# EAGLE design AFE_Only_ReplacedDischarge (EAGLE 8.0.2)

## Sheet 1 of 2
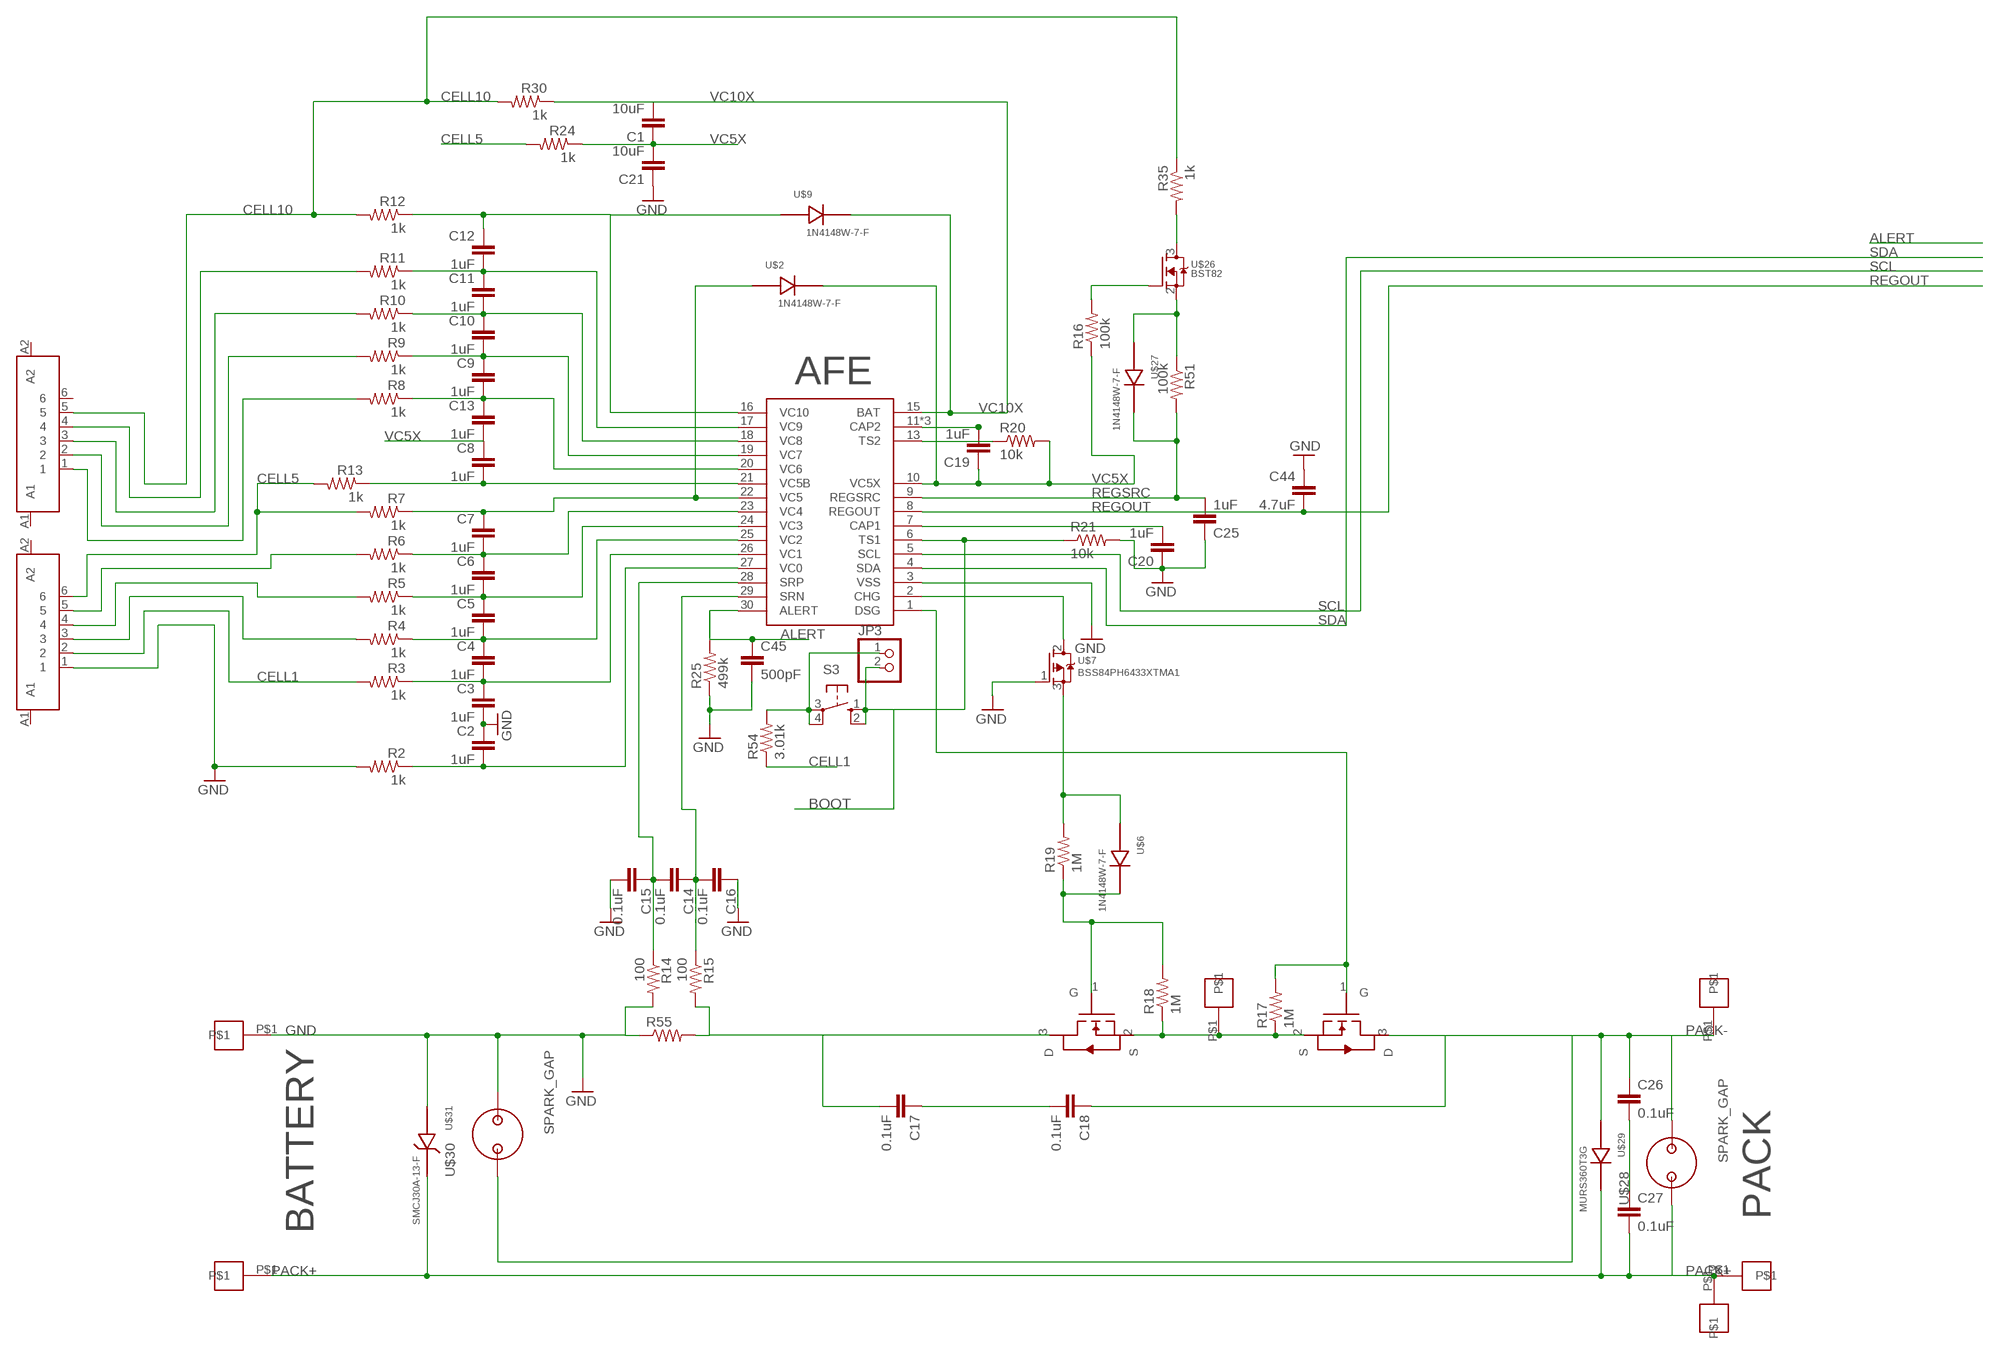
[diagram p0: schematic, sheet 1]

### Parts
C1  10uF  C-EUC1210  [C1210]
C2  1uF  C-EUC0805  [C0805]
C3  1uF  C-EUC0805  [C0805]
C4  1uF  C-EUC0805  [C0805]
C5  1uF  C-EUC0805  [C0805]
C6  1uF  C-EUC0805  [C0805]
C7  1uF  C-EUC0805  [C0805]
C8  1uF  C-EUC0805  [C0805]
C9  1uF  C-EUC0805  [C0805]
C10  1uF  C-EUC0805  [C0805]
C11  1uF  C-EUC0805  [C0805]
C12  1uF  C-EUC0805  [C0805]
C13  1uF  C-EUC0805  [C0805]
C14  0.1uF  C-EUC0805  [C0805]
C15  0.1uF  C-EUC0805  [C0805]
C16  0.1uF  C-EUC0805  [C0805]
C17  0.1uF  C-EUC0805  [C0805]
C18  0.1uF  C-EUC0805  [C0805]
C19  1uF  C-EUC0805  [C0805]
C20  1uF  C-EUC0805  [C0805]
C21  10uF  C-EUC1210  [C1210]
C25  1uF  C-EUC0805  [C0805]
C26  0.1uF  C-EUC0805  [C0805]
C27  0.1uF  C-EUC0805  [C0805]
C44  4.7uF  C-EUC0805  [C0805]
C45  500pF  C-EUC0603  [C0603]
JP3  PINHD-1X2  [1X02]
R2  1k  R-US_R1206  [R1206]
R3  1k  R-US_R1206  [R1206]
R4  1k  R-US_R1206  [R1206]
R5  1k  R-US_R1206  [R1206]
R6  1k  R-US_R1206  [R1206]
R7  1k  R-US_R1206  [R1206]
R8  1k  R-US_R1206  [R1206]
R9  1k  R-US_R1206  [R1206]
R10  1k  R-US_R1206  [R1206]
R11  1k  R-US_R1206  [R1206]
R12  1k  R-US_R1206  [R1206]
R13  1k  R-US_R1206  [R1206]
R14  100  R-US_R0805  [R0805]
R15  100  R-US_R0805  [R0805]
R16  100k  R-US_R0805  [R0805]
R17  1M  R-US_R1206  [R1206]
R18  1M  R-US_R1206  [R1206]
R19  1M  R-US_R1206  [R1206]
R20  10k  R-US_R0805  [R0805]
R21  10k  R-US_R0805  [R0805]
R24  1k  R-US_R1206  [R1206]
R25  499k  R-US_R0603  [R0603]
R30  1k  R-US_R1206  [R1206]
R35  1k  R-US_R1206  [R1206]
R51  100k  R-US_R0805  [R0805]
R54  3.01k  R-US_R1206  [R1206]
R55  R-US_R2512  [R2512]
S3  10-XX  [B3F-10XX]
U$1  BQ76930  [SOIC-30]
U$2  1N4148W-7-F  [SOD-123]
U$3  PAD  [PAD]
U$4  AOB290L  [TO-263]
U$5  AOB290L  [TO-263]
U$6  1N4148W-7-F  [SOD-123]
U$7  BSS84PH6433XTMA1  [SOT23-3]
U$9  1N4148W-7-F  [SOD-123]
U$24  JST_6PIN  [JST_6PIN]
U$26  BST82  [SOT23-3]
U$27  1N4148W-7-F  [SOD-123]
U$28  SPARK_GAP  [SPARK_GAP]
U$29  MURS360T3G  [SMC(DO-214AB)]
U$30  SPARK_GAP  [SPARK_GAP]
U$31  SMCJ30A-13-F  [SMB(DO-214AA)]
U$33  JST_6PIN  [JST_6PIN]
U$35  PAD  [PAD]
U$36  PAD  [PAD]
U$37  PAD  [PAD]
U$38  PAD  [PAD]
U$39  PAD  [PAD]

### Nets
ALERT: C45.1 R25.2 U$1.30(ALERT) ; also sheet 2
BOOT: JP3.2 R21.1 S3.1(S) S3.2(S1) U$1.6(TS1)
CELL1: R3.2 R54.1 U$33.2
CELL5: R7.2 R13.2 R24.2 U$33.6
CELL10: R12.2 R30.2 R35.1 U$24.5
CHARGE-: R17.1 R18.1 U$4.2(S) U$5.2(S) U$37.P$1
GND: C2.1 C3.2 C15.2 C16.1 C20.1 C21.1 C25.1 C44.1 C45.2 R2.2 R14.2 R21.2 R25.1 R55.1 U$1.3(VSS) U$3.P$1 U$7.1(G) U$30.P$2 U$31.P$1 U$33.1 ; also sheet 2
N$1: C3.1 C4.2 R3.1 U$1.26(VC1)
N$2: C4.1 C5.2 R4.1 U$1.25(VC2)
N$3: C5.1 C6.2 R5.1 U$1.24(VC3)
N$4: C6.1 C7.2 R6.1 U$1.23(VC4)
N$5: C7.1 R7.1 U$1.22(VC5) U$2.P$1
N$6: C8.2 R13.1 U$1.21(VC5B)
N$7: C9.1 C10.2 R9.1 U$1.19(VC7)
N$8: C10.1 C11.2 R10.1 U$1.18(VC8)
N$9: C11.1 C12.2 R11.1 U$1.17(VC9)
N$10: C12.1 R12.1 U$1.16(VC10) U$9.P$1
N$11: R5.2 U$33.4
N$12: C2.2 R2.1 U$1.27(VC0)
N$14: C26.2 C27.1
N$15: R4.2 U$33.3
N$16: R6.2 U$33.5
N$18: R8.2 U$24.1
N$19: R9.2 U$24.2
N$20: R10.2 U$24.3
N$21: R11.2 U$24.4
N$23: C9.2 C13.1 R8.1 U$1.20(VC6)
N$24: R16.2 U$26.1(G)
N$25: C20.2 U$1.7(CAP1)
N$26: C14.1 C16.2 R15.1 U$1.29(SRN)
N$27: JP3.1 R54.2 S3.3(P) S3.4(P1)
N$28: C14.2 C15.1 R14.1 U$1.28(SRP)
N$32: R18.2 R19.1 U$5.1(G) U$6.P$2
N$33: R19.2 U$6.P$1 U$7.3(D)
N$34: U$1.2(CHG) U$7.2(S)
N$35: C17.1 C18.2
N$37: C19.2 U$1.11(CAP2) U$1.12(CAP2) U$1.14(CAP2)
N$38: R20.1 U$1.13(TS2)
N$39: C17.2 R15.2 R55.2 U$5.3(D)
N$42: R17.2 U$1.1(DSG) U$4.1(G)
N$70: R51.1 U$26.2(S) U$27.P$1
N$72: R35.2 U$26.3(D)
PACK+: C27.2 U$28.P$1 U$29.2 U$31.P$2 U$35.P$1 U$36.P$1 U$39.P$1
PACK-: C18.1 C26.1 U$4.3(D) U$28.P$2 U$29.1 U$30.P$1 U$38.P$1
REGOUT: C44.2 U$1.8(REGOUT) ; also sheet 2
REGSRC: C25.2 R51.2 U$1.9(REGSRC) U$27.P$2
SCL: U$1.5(SCL) ; also sheet 2
SDA: U$1.4(SDA) ; also sheet 2
VC5X: C1.1 C8.1 C13.2 C19.1 C21.2 R16.1 R20.2 R24.1 U$1.10(VC5X) U$2.P$2
VC10X: C1.2 R30.1 U$1.15(BAT) U$9.P$2
Unconnected: U$24.6 U$24.A1 U$24.A2 U$33.A1 U$33.A2

### Notes on the sheet
- AFE
- PACK
- BATTERY

## Sheet 2 of 2
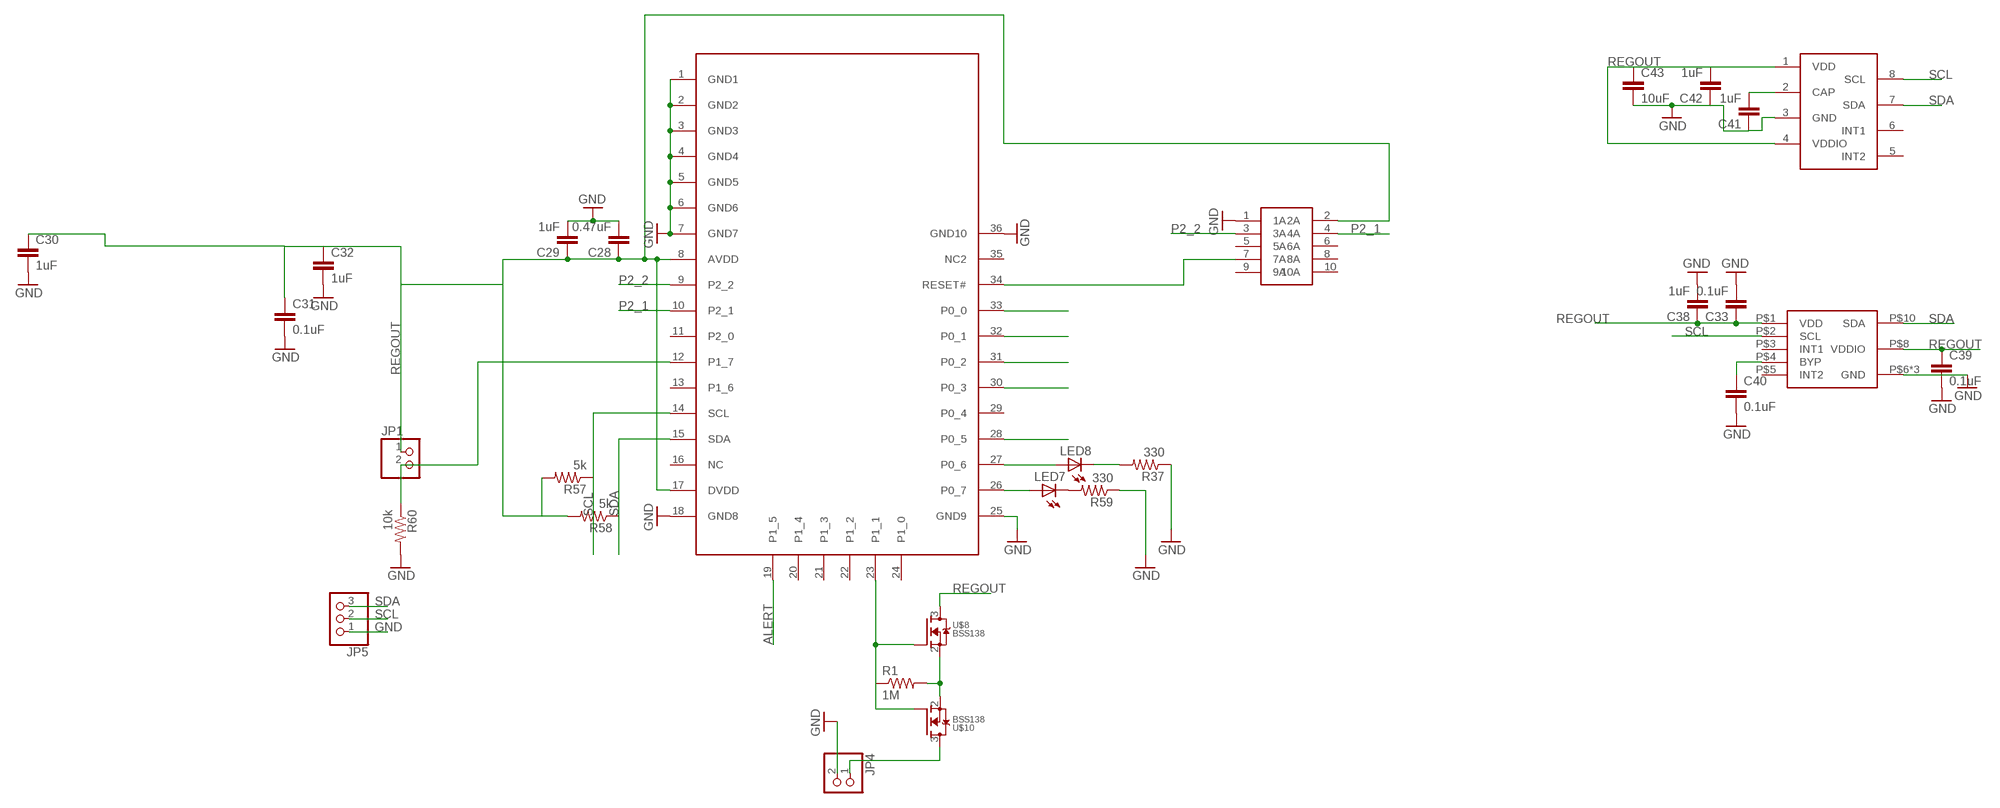
[diagram p1: schematic, sheet 2]

### Parts
C28  0.47uF  C-EUC0402  [C0402]
C29  1uF  C-EUC0402  [C0402]
C30  1uF  C-EUC0402  [C0402]
C31  0.1uF  C-EUC0402  [C0402]
C32  1uF  C-EUC0402  [C0402]
C33  0.1uF  C-EUC0402  [C0402]
C38  1uF  C-EUC0402  [C0402]
C39  0.1uF  C-EUC0402  [C0402]
C40  0.1uF  C-EUC0402  [C0402]
C41  1uF  C-EUC0402  [C0402]
C42  1uF  C-EUC0402  [C0402]
C43  10uF  C-EUC0603  [C0603]
JP1  PINHD-1X2  [1X02]
JP4  PINHD-1X2  [1X02]
JP5  PINHD-1X3  [1X03]
LED7  LEDCHIP-LED0603  [CHIP-LED0603]
LED8  LEDCHIP-LED0603  [CHIP-LED0603]
R1  1M  R-US_R0402  [R0402]
R37  330  R-US_R0402  [R0402]
R57  5k  R-US_R0402  [R0402]
R58  5k  R-US_R0402  [R0402]
R59  330  R-US_R0402  [R0402]
R60  10k  R-US_R0402  [R0402]
U$8  BSS138  [SOT23-3]
U$10  BSS138  [SOT23-3]
U$20  BLE113  [BLUEGIGA]
U$22  RIBBON_10POS_MALE  [RIBBON_10POS_MALE]
U$25  MLP3115A2  [MLP3115A2]
U$32  MMA8653FC  [10-DFN2X2]

### Nets
ALERT: U$20.19(P1_5) ; also sheet 1
CARD2: U$20.32(P0_1)
CD: U$20.33(P0_0)
CLK: U$20.28(P0_5)
GND: C28.2 C29.2 C30.2 C31.2 C32.2 C33.2 C38.2 C39.2 C40.2 C41.1 C42.1 C43.2 JP4.2 JP5.1 R37.1 R59.1 R60.2 U$20.1(GND1) U$20.2(GND2) U$20.3(GND3) U$20.4(GND4) U$20.5(GND5) U$20.6(GND6) U$20.7(GND7) U$20.18(GND8) U$20.25(GND9) U$20.36(GND10) U$22.1(1A) U$25.3(GND) U$32.P$6(GND) U$32.P$7(GND) U$32.P$9(GND) ; also sheet 1
MISO: U$20.31(P0_2)
MOSI: U$20.30(P0_3)
N$13: LED8.A U$20.27(P0_6)
N$17: LED8.C R37.2
N$22: R1.1 U$8.1(G) U$10.1(G) U$20.23(P1_1)
N$29: JP4.1 U$10.3(D)
N$30: R1.2 U$8.2(S) U$10.2(S)
N$36: LED7.A U$20.26(P0_7)
N$71: JP1.2 R60.1 U$20.12(P1_7)
N$76: LED7.C R59.2
N$77: U$20.34(RESET#) U$22.7(7A)
N$81: C41.2 U$25.2(CAP)
N$84: C40.1 U$32.P$4(BYP)
P2_1: U$20.10(P2_1) U$22.4(4A)
P2_2: U$20.9(P2_2) U$22.3(3A)
REGOUT: C28.1 C29.1 C30.1 C31.1 C32.1 C33.1 C38.1 C39.1 C42.2 C43.1 JP1.1 R57.2 R58.2 U$8.3(D) U$20.8(AVDD) U$20.17(DVDD) U$22.2(2A) U$25.1(VDD) U$25.4(VDDIO) U$32.P$1(VDD) U$32.P$8(VDDIO) ; also sheet 1
SCL: JP5.2 R57.1 U$20.14(SCL) U$25.8(SCL) U$32.P$2(SCL) ; also sheet 1
SDA: JP5.3 R58.1 U$20.15(SDA) U$25.7(SDA) U$32.P$10(SDA) ; also sheet 1
Unconnected: U$20.11(P2_0) U$20.13(P1_6) U$20.16(NC) U$20.20(P1_4) U$20.21(P1_3) U$20.22(P1_2) U$20.24(P1_0) U$20.29(P0_4) U$20.35(NC2) U$22.5(5A) U$22.6(6A) U$22.8(8A) U$22.9(9A) U$22.10(10A) U$25.5(INT2) U$25.6(INT1) U$32.P$3(INT1) U$32.P$5(INT2)

## Library data of the parts
C1-C21 C25-C33 C38-C45 = rcl:C-EU: CAPACITOR, European symbol
JP1 JP3 JP4 = pinhead:PINHD-1X2: PIN HEADER
JP5 = pinhead:PINHD-1X3: PIN HEADER
LED7 LED8 = adafruit:LED: LED OSRAM: - CHIPLED LG R971, LG N971, LY N971, LG Q971, LY Q971, LO R971, LY R971 LH N974, LH R974 LS Q976, LO Q976, LY Q976 LO Q996 - Hyper CHIPLED LW Q18S LB Q993, LB Q99A, LB R99A - SideLED LS A670, LO A670, LY A670, LG A670, LP A670 LB A673, LV A673, LT A673, LW A673 LH A674 LY A675 LS A676, LA A676, LO A676, LY A676, LW A676 LS A679, LY A679, LG A679 - Hyper Micro SIDELED® LS Y876, LA Y876, LO Y876, LY Y876 LT Y87S - SmartLED LW L88C, LW L88S LB L89C, LB L89S, LG L890 LS L89K, LO L89K, LY L89K LS L896, LA L896, LO L896, LY L896 - TOPLED LS T670, LO T670, LY T670, LG T670, LP T670 LSG T670, LSP T670, LSY T670, LOP T670, LYG T670 LG T671, LOG T671, LSG T671 LB T673, LV T673, LT T673, LW T673 LH T674 LS T676, LA T676, LO T676, LY T676, LB T676, LH T676, LSB T676, LW T676 LB T67C, LV T67C, LT T67C, LS T67K, LO T67K, LY T67K, LW E67C LS E67B, LA E67B, LO E67B, LY E67B, LB E67C, LV E67C, LT E67C LW T67C LS T679, LY T679, LG T679 LS T770, LO T770, LY T770, LG T770, LP T770 LB T773, LV T773, LT T773, LW T773 LH T774 LS E675, LA E675, LY E675, LS T675 LS T776, LA T776, LO T776, LY T776, LB T776 LHGB T686 LT T68C, LB T68C - Hyper Mini TOPLED® LB M676 - Mini TOPLED Santana® LG M470 LS M47K, LO M47K, LY M47K Source: http://www.osram.convergy.de/
R1-R21 R24 R25 R30 R35 R37 R51 R54 R55 R57-R60 = rcl:R-US_: RESISTOR, American symbol
S3 = switch-omron:10-XX: OMRON SWITCH; MPN: B3F-1000; OC_FARNELL: 176432; OC_NEWARK: 36M3542
U$1 = Charles:BQ76930
U$2 U$6 U$9 U$27 = Charles:1N4148W-7-F: DIODE GENERAL PURPOSE 100V 300MA
U$3 U$35-U$39 = Charles:PAD
U$4 U$5 = Charles:AOB290L
U$7 = Charles:BSS84PH6433XTMA1: MOSFET P-Channel 60V 170MA SOT-23
U$8 U$10 = Charles:BSS138: MOSFET N-CH 50V 220MA
U$20 = James_Updated:BLE113
U$22 = James_Updated:RIBBON_10POS_MALE
U$24 U$33 = James_Updated:JST_6PIN
U$25 = Charles:MLP3115A2: I2C Precision Altimeter
U$26 = Charles:BST82: MOSFET N-CH 50V 220MA
U$28 U$30 = Charles:SPARK_GAP: Spark Gap 0.2mm ~2kV for ESD Protection
U$29 = Charles:MURS360T3G: Ultrafast Power Rectifier, Diode General Purpose 600V 3A
U$31 = Charles:SMCJ30A-13-F: Zener Diode - 600 Watt Transient Voltage Suppressor - 30VWM 48.4VC - Diode Inc.
U$32 = Charles:MMA8653FC: 3-Axis, 10-bit Digital Accelerometer

## Board
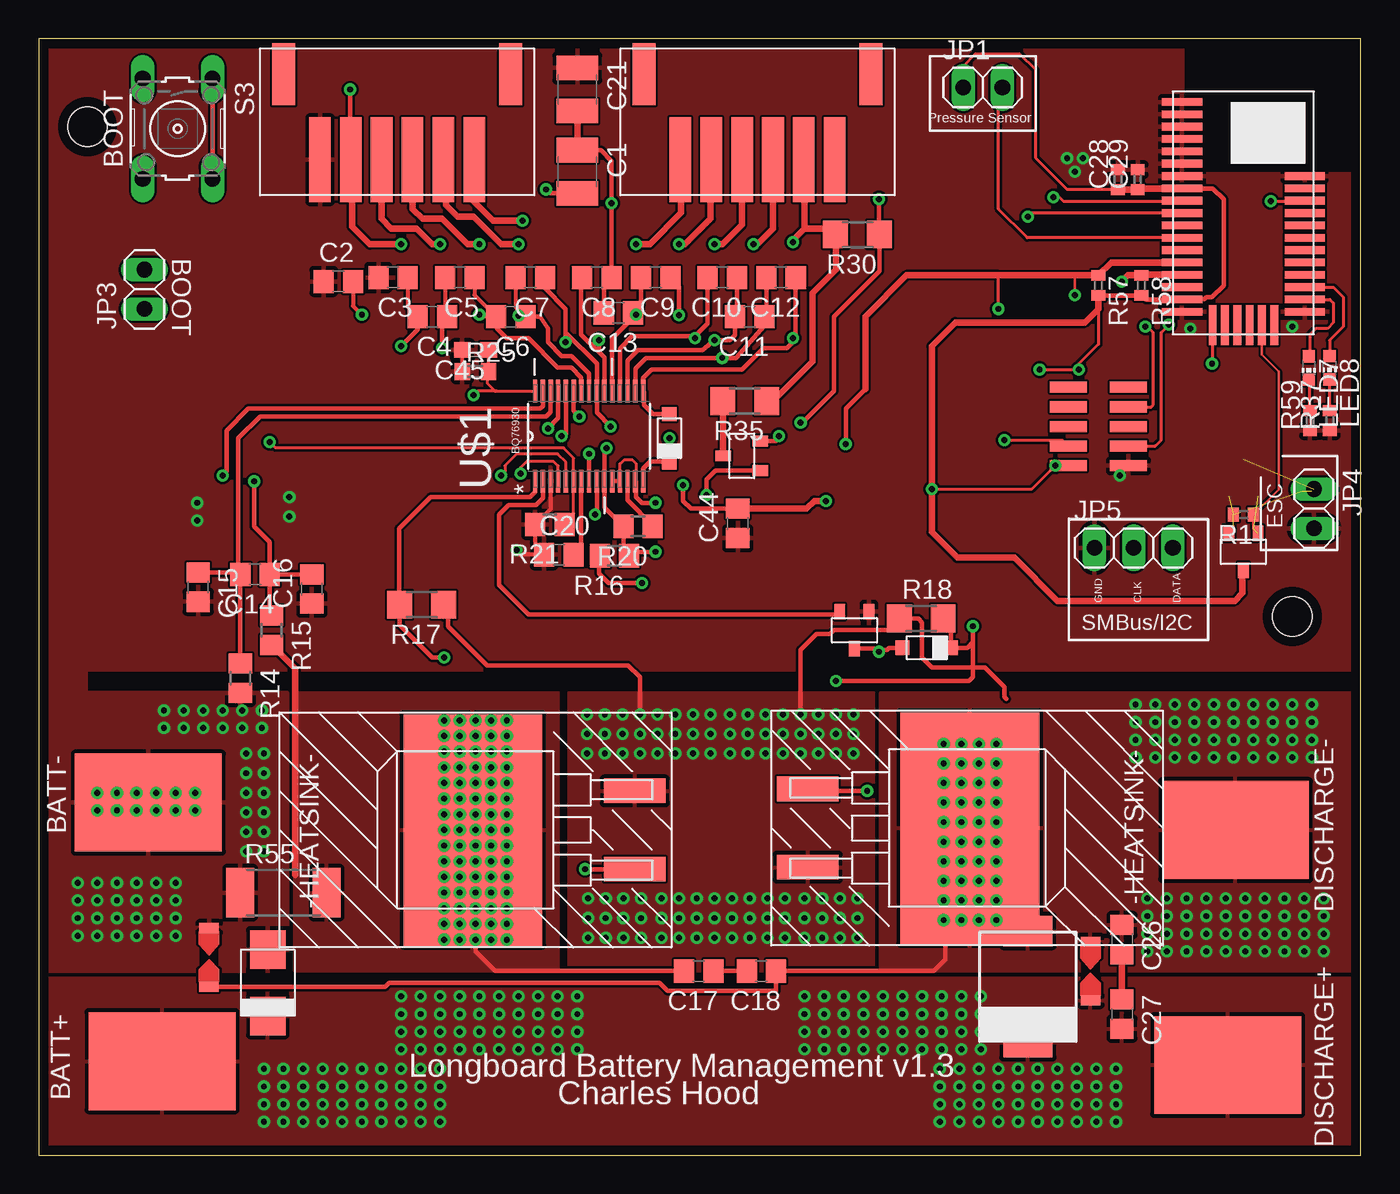
[diagram p2: board, top side]
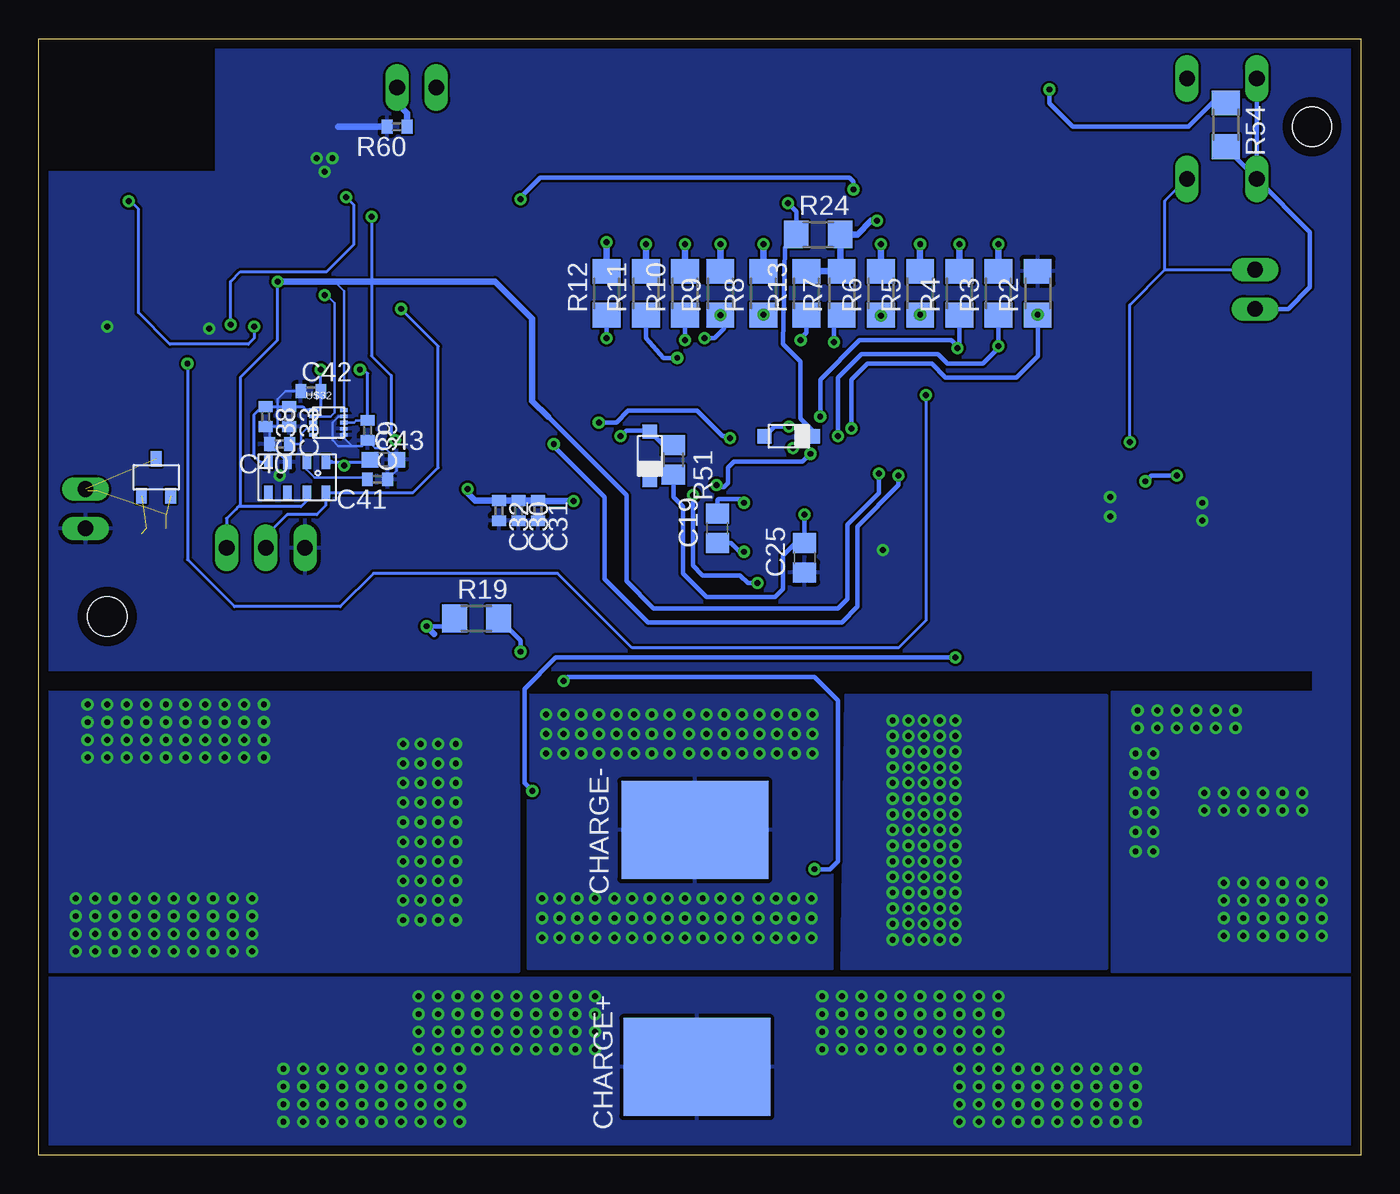
[diagram p3: board, bottom side, seen from below]

Size 85.72 x 72.39 mm. Coordinates in mm from the lower left corner, seen from the top.
Outline: 85.72,0 85.72,72.39 0,72.39 0,0 85.72,0
Copper layers (1*16): Top 0.035mm / dielectric 1.5mm / Bottom 0.035mm
Design rules "DRC_rules": minimum track width 8mil, minimum drill 15mil, track to track 6mil, track to pad 6mil, pad to pad 6mil, via to via 6mil, smd to smd 6mil, copper to edge 25mil, drill to drill 6mil, minimum pad ring 10mil, minimum via ring 8mil, stop-mask expansion 4mil, vias tented up to drill 0mil, thermal gap 10mil
Holes 2.54 mm at 3.17,66.67 81.28,34.92
tRestrict: area 74.3,63.8 to 86.5,72.4
bRestrict: area 74.3,63.8 to 86.5,72.4

### Footprints (pad centres in the part's own frame; a part is rotated, then mirrored left to right if it is on the bottom)
C1210 = smd 1.6 x 2.7: 1 -1.4,0; 2 1.4,0
C0805 = smd 1.3 x 1.5: 1 -0.95,0; 2 0.95,0
C0402 = smd 0.7 x 0.9: 1 -0.65,0; 2 0.65,0
C0603 = smd 1.1 x 1: 1 -0.85,0; 2 0.85,0
1X02 = drill 1.016 long: 1 -1.27,0; 2 1.27,0
1X03 = drill 1.016 long: 1 -2.54,0; 2 0,0; 3 2.54,0
CHIP-LED0603 = smd 0.8 x 0.8: A 0,-0.75; C 0,0.75
R0402 = smd 0.7 x 0.9: 1 -0.65,0; 2 0.65,0
R1206 = smd 1.6 x 1.803: 1 -1.422,0; 2 1.422,0
R0805 = smd 1.3 x 1.5: 1 -0.95,0; 2 0.95,0
R0603 = smd 1 x 1.1: 1 -0.85,0; 2 0.85,0
R2512 = smd 1.8 x 3.2: 1 -2.8,0; 2 2.8,0
B3F-10XX = drill 1.016 long: 1 -3.251,2.261; 2 3.251,2.261; 3 -3.251,-2.261; 4 3.251,-2.261
SOIC-30 = smd 1.473 x 0.279: 1 -2.921,3.505; 2 -2.921,2.997; 3 -2.921,2.489; 4 -2.921,2.007; 5 -2.921,1.499; 6 -2.921,0.991; 7 -2.921,0.508; 8 -2.921,0; 9 -2.921,-0.508; 10 -2.921,-0.991; 11 -2.921,-1.499; 12 -2.921,-2.007; 13 -2.921,-2.489; 14 -2.921,-2.997; 15 -2.921,-3.505; 16 2.921,-3.505; 17 2.921,-2.997; 18 2.921,-2.489; 19 2.921,-2.007; 20 2.921,-1.499; 21 2.921,-0.991; 22 2.921,-0.508; 23 2.921,0; 24 2.921,0.508; 25 2.921,0.991; 26 2.921,1.499; 27 2.921,2.007; 28 2.921,2.489; 29 2.921,2.997; 30 2.921,3.505
SOD-123 = smd 0.9 x 0.95: P$1 -1.575,0; P$2 1.575,0
PAD = smd 9.525 x 6.35: P$1 0,0
TO-263 = smd 1.6 x 4: 1 -2.54,-5.25; 2 2.54,-5.25 | smd 15 x 9: 3 0,5.25
SOT23-3 = smd 0.7 x 1: 1 -0.95,-1.2; 2 0.95,-1.2; 3 0,1.2
BLUEGIGA = smd 2.6 x 0.5: 1 -3.975,9.6; 2 -3.975,8.8; 3 -3.975,8; 4 -3.975,7.2; 5 -3.975,6.4; 6 -3.975,5.6; 7 -3.975,4.8; 8 -3.975,4; 9 -3.975,3.2; 10 -3.975,2.4; 11 -3.975,1.6; 12 -3.975,0.8; 13 -3.975,0; 14 -3.975,-0.8; 15 -3.975,-1.6; 16 -3.975,-2.4; 17 -3.975,-3.2; 18 -3.975,-4; 25 3.975,-4; 26 3.975,-3.2; 27 3.975,-2.4; 28 3.975,-1.6; 29 3.975,-0.8; 30 3.975,0; 31 3.975,0.8; 32 3.975,1.6; 33 3.975,2.4; 34 3.975,3.2; 35 3.975,4; 36 3.975,4.8 | smd 0.5 x 2.6: 19 -2,-4.85; 20 -1.2,-4.85; 21 -0.4,-4.85; 22 0.4,-4.85; 23 1.2,-4.85; 24 2,-4.85
RIBBON_10POS_MALE = smd 0.72 x 2.4: 1 -5.08,-1.95; 2 -5.08,1.95; 3 -3.81,-1.95; 4 -3.81,1.95; 5 -2.54,-1.95; 6 -2.54,1.95; 7 -1.27,-1.95; 8 -1.27,1.95; 9 0,-1.95; 10 0,1.95
JST_6PIN = smd 1.4 x 5.5: 1 -5,-2.775; 2 -3,-2.775; 3 -1,-2.775; 4 1,-2.775; 5 3,-2.775; 6 5,-2.775 | smd 1.5 x 4: A1 -7.35,2.775; A2 7.35,2.775
MLP3115A2 = smd 0.95 x 0.55: 1 -1,1.875; 2 -1,0.625; 3 -1,-0.625; 4 -1,-1.875; 5 1,-1.875; 6 1,-0.625; 7 1,0.625; 8 1,1.875
SPARK_GAP = smd 1.27 x 0.635: P$1 0,1.905; P$2 0,-1.905
SMC(DO-214AB) = smd 1.96 x 3.2: 1 -3.6,0; 2 3.6,0
SMB(DO-214AA) = smd 2.5 x 2.3: P$1 -2.15,0; P$2 2.15,0
10-DFN2X2 = smd 0.5 x 0.24: P$1 -1,0.8; P$2 -1,0.4; P$3 -1,0; P$4 -1,-0.4; P$5 -1,-0.8; P$6 1,-0.8; P$7 1,-0.4; P$8 1,0; P$9 1,0.4; P$10 1,0.8

### Placement (x,y rotation side)
C1  34.92,63.75 270 top
C2  19.43,56.64 0 top
C3  22.99,56.9 180 top
C4  25.53,54.36 180 top
C5  27.3,56.9 180 top
C6  30.61,54.36 180 top
C7  31.88,56.9 180 top
C8  36.2,56.9 180 top
C9  40.01,56.9 180 top
C10  44.32,56.9 180 top
C11  46.1,54.36 180 top
C12  48.13,56.9 180 top
C13  37.59,54.61 180 top
C14  14.03,37.66 180 top
C15  10.35,36.83 270 top
C16  17.72,36.7 90 top
C17  42.8,11.94 180 top
C18  46.86,11.94 180 top
C19  41.72,40.64 90 bottom
C20  33.72,38.93 0 top
C21  34.92,69.09 270 top
C25  36.07,38.73 90 bottom
C26  70.23,13.97 270 top
C27  70.23,9.14 270 top
C28  69.98,63.25 90 top
C29  71.25,63.25 90 top
C30  54.61,41.78 270 bottom
C31  53.34,41.78 270 bottom
C32  55.88,41.78 270 bottom
C33  69.47,47.88 270 bottom
C38  70.99,47.88 270 bottom
C39  64.39,46.99 270 bottom
C40  70.1,46.1 180 bottom
C41  63.75,43.81 180 bottom
C42  68.07,49.53 0 bottom
C43  63.37,45.09 0 bottom
C44  45.33,40.96 90 top
C45  28.32,52.2 180 top
JP1  61.21,69.22 0 top
JP3  6.86,56.13 90 top
JP4  82.68,41.91 270 top
JP5  70.99,39.37 0 top
LED7  82.35,51.03 180 top
LED8  83.69,51.05 180 top
R1  78.1,41.53 180 top
R2  20.95,55.88 90 bottom
R3  23.5,55.88 90 bottom
R4  26.04,55.88 90 bottom
R5  28.58,55.88 90 bottom
R6  31.12,55.88 90 bottom
R7  33.66,55.88 90 bottom
R8  38.73,55.88 90 bottom
R9  41.53,55.88 90 bottom
R10  43.81,55.88 90 bottom
R11  46.35,55.88 90 bottom
R12  48.9,55.88 90 bottom
R13  35.94,55.88 90 bottom
R14  13.08,30.92 270 top
R15  15.11,34.04 270 top
R16  37.34,38.86 180 top
R17  24.83,35.69 180 top
R18  57.23,34.8 0 top
R19  57.33,34.8 0 bottom
R20  38.86,40.77 180 top
R21  33.15,40.89 180 top
R24  35.18,59.69 0 bottom
R25  28.32,50.8 0 top
R30  53.09,59.69 180 top
R35  45.78,48.9 180 top
R37  83.69,47.62 90 top
R51  44.58,45.09 270 bottom
R54  8.76,66.8 270 bottom
R55  15.88,17.02 0 top
R57  68.71,56.39 270 top
R58  71.5,56.39 270 top
R59  82.42,47.62 90 top
R60  62.48,66.67 180 bottom
S3  9.02,66.55 270 top
U$1  35.69,46.61 90 top
U$2  37.08,46.61 0 bottom
U$3  7.11,22.86 0 top
U$4  55.12,21.21 270 top
U$5  33.4,21.08 90 top
U$6  57.58,32.89 0 top
U$7  52.88,34.04 180 top
U$8  78.1,39.12 180 top
U$9  40.89,46.48 270 top
U$10  78.1,43.94 0 bottom
U$20  78.1,58.67 0 top
U$22  68.71,49.78 90 top
U$24  46.61,67.31 0 top
U$25  68.96,43.94 270 bottom
U$26  45.59,45.34 90 top
U$27  46.1,45.34 270 bottom
U$28  68.2,11.94 180 top
U$29  64.13,10.92 270 top
U$30  11.05,12.83 180 top
U$31  14.86,11.18 270 top
U$32  66.93,47.5 0 bottom
U$33  23.24,67.31 0 top
U$35  8,6.1 0 top
U$36  77.09,5.84 180 top
U$37  43.18,21.08 180 bottom
U$38  77.6,21.08 0 top
U$39  43.05,5.71 180 bottom

### Tracks (layer width: path | path; a pad name or v marks a point on that pad's centre or on a via)
ALERT  (via drill 0.38)
  Top 0.203: 29.72,49.53 U$1.30 | 29.72,49.53 29.59,49.53 | 29.59,49.53 29.08,50.04 29.08,50.42 29.08,50.71 R25.2 C45.1 | 29.72,49.53 28.45,49.53 v28.19,49.28 | U$20.19 76.1,51.34 v76.07,51.31 | 29.59,49.53 29.72,49.53
  Top 0.254: R25.2 29.17,50.51 29.08,50.42
  Bottom 0.203: v28.19,49.28 28.19,34.67 29.97,32.89 47.24,32.89 52.07,37.72 64.01,37.72 66.17,35.56 73.03,35.56 76.07,38.61 v76.07,51.31
BOOT  (via drill 0.38)
  Top 0.203: R21.1 34.7,41.62 U$1.6 34.7,45.19 34.04,45.85 15.37,45.85 v14.99,46.23
  Top 0.305: S3.2 S3.1
  Bottom 0.203: v14.99,46.23 14.99,55.12 12.7,57.4 | 12.7,57.4 JP3.2 | 12.7,57.4 12.7,61.87 S3.2
CELL1  (via drill 0.38)
  Top 0.305: v20.19,69.09 20.19,64.58 U$33.2
  Top 0.406: v23.5,59.05 21.46,59.05 20.32,60.2 20.32,64.46 U$33.2
  Bottom 0.305: R54.1 9.63,68.22 11.18,66.67 18.67,66.67 20.19,68.2 v20.19,69.09
  Bottom 0.406: R3.2 v23.5,59.05
CELL5  (via drill 0.38)
  Top 0.406: v31.37,60.58 29.46,60.58 28.19,61.85 28.19,64.49 U$33.6
  Bottom 0.406: v31.37,60.58 31.75,60.58 32.64,59.69 R24.2 33.76,57.4 R7.2 R13.2
CELL10  (via drill 0.38)
  Top 0.406: v48.9,59.18 48.9,59.31 49.66,60.07 | 49.66,60.07 49.66,64.49 U$24.5 | 49.66,60.07 51.28,60.07 R30.2 51.69,59.66 51.69,57.4 50.16,55.88 50.16,51.44 47.62,48.9 R35.1
  Bottom 0.406: v48.9,59.18 R12.2
CHARGE-  (via drill 0.38)
  Top 0.203: R17.1 26.25,34.84
  Top 0.305: 62.74,29.59 62.61,29.72 62.61,30.35 61.34,31.62 57.91,31.62 57.28,32.26 57.28,34.54 57.02,34.8 R18.1 55.04,34.04 51.56,34.04 51.31,33.78 50.42,33.78 49.4,32.77 v49.4,28.57 | v38.99,28.57 38.99,30.99 38.23,31.75 29.08,31.75 26.54,34.29 26.54,35.4 R17.1
  other vias: 44.83,26.04 44.83,27.3 44.83,28.57 45.97,26.04 45.97,27.3 45.97,28.57 47.12,26.04 47.12,27.3 47.12,28.57 48.26,26.04 48.26,27.3 48.26,28.57 50.8,14.1 50.8,15.37 50.8,16.64 49.66,14.1 49.66,15.37 49.66,16.64 51.94,14.1 51.94,15.37 51.94,16.64 53.09,14.1 53.09,15.37 53.09,16.64 36.7,26.04 36.7,27.3 36.7,28.57 35.56,26.04 35.56,27.3 35.56,28.57 37.85,26.04 37.85,27.3 37.85,28.57 38.99,26.04 38.99,27.3 36.77,14.1 36.77,15.37 36.77,16.64 35.62,14.1 35.62,15.37 35.62,16.64 37.91,14.1 37.91,15.37 37.91,16.64 39.05,14.1 39.05,15.37 39.05,16.64 49.4,26.04 49.4,27.3 50.55,26.04 50.55,27.3 50.55,28.57 51.69,26.04 51.69,27.3 51.69,28.57 52.83,26.04 52.83,27.3 52.83,28.57 41.27,26.04 41.27,27.3 41.27,28.57 40.13,26.04 40.13,27.3 40.13,28.57 42.42,26.04 42.42,27.3 42.42,28.57 43.56,26.04 43.56,27.3 43.56,28.57 41.53,14.1 41.53,15.37 41.53,16.64 40.39,14.1 40.39,15.37 40.39,16.64 42.67,14.1 42.67,15.37 42.67,16.64 43.81,14.1 43.81,15.37 43.81,16.64 46.1,14.1 46.1,15.37 46.1,16.64 44.96,14.1 44.96,15.37 44.96,16.64 47.24,14.1 47.24,15.37 47.24,16.64 48.39,14.1 48.39,15.37 48.39,16.64
  pour Bottom: 34.29,12.06 53.98,12.06 53.98,29.84 34.29,29.84
  pour Top: 34.42,11.94 34.42,29.97 54.1,29.97 54.1,11.94
GND  (via drill 0.38)
  Top 0.203: U$22.1 70.66,44.62 v70.1,44.07 | C45.2 R25.1
  Top 0.254: U$1.3 33.2,41.9 R21.2 32.2,39.5 C20.1 31.18,38.92 30.99,39.12 v30.99,39.24
  Bottom 0.152: U$25.3 C40.2 70.75,46.99 C38.2 70.23,47.23 | C33.2 70.23,47.23 | C42.1 69.72,49.53 70.23,49.02 70.23,47.23 | U$32.P$9 66.28,47.9 66.68,47.5 66.68,46.35 66.29,45.97 65.41,45.97 | 65.41,45.97 64.75,45.97 C39.2 63.9,45.85 63.25,45.85 62.52,45.12 C43.2 62.52,44.4 C41.1 | U$32.P$6 65.93,46.5 65.41,45.97
  Bottom 0.203: U$32.P$7 U$32.P$6 | U$25.3 69.59,44.59 v70.1,44.07 70.23,43.94
  Bottom 0.406: R60.2 66.31,66.67
  other vias: 81.28,53.72 74.68,53.59 10.29,42.29 10.29,41.15 16.26,42.67 16.26,41.4 66.68,64.64 67.69,64.64 67.18,63.75 2.54,17.65 3.81,17.65 5.08,17.65 6.35,17.65 7.62,17.65 8.89,16.51 8.89,17.65 8.89,15.37 2.54,16.51 3.81,16.51 5.08,16.51 6.35,16.51 7.62,16.51 2.54,15.37 3.81,15.37 5.08,15.37 6.35,15.37 7.62,15.37 2.54,14.22 3.81,14.22 5.08,14.22 6.35,14.22 7.62,14.22 8.89,14.22 3.81,23.5 5.08,23.5 6.35,23.5 7.62,23.5 8.89,23.5 10.16,22.35 10.16,23.5 3.81,22.35 5.08,22.35 6.35,22.35 7.62,22.35 8.89,22.35 8.13,28.83 9.4,28.83 10.67,28.83 11.94,28.83 13.21,28.83 14.48,27.69 14.48,28.83 8.13,27.69 9.4,27.69 10.67,27.69 11.94,27.69 13.21,27.69 13.46,19.68 13.46,20.95 13.46,22.23 13.46,23.5 13.46,24.77 14.61,26.04 13.46,26.04 14.61,19.68 14.61,20.95 14.61,22.23 14.61,23.5 14.61,24.77
  pour Top: 0,72.39 85.72,72.39 85.72,31.5 3.05,31.5 3.05,29.97 16.13,29.97 16.13,11.94 0,11.94
  pour Bottom: 0,31.5 85.72,31.5 85.72,72.14 0,72.14
  pour Bottom: 0,31.5 3.05,31.5 3.05,29.97 16.13,29.97 16.13,11.94 0,11.94
N$1  (via drill 0.38)
  Top 0.254: C3.1 23.94,55 C4.2
  Top 0.305: U$1.26 34.19,46.76 34.04,46.61 v33.91,46.61 | C4.2 24.58,53.53 v23.5,52.45
  Bottom 0.305: v33.91,46.61 33.91,50.42 32.38,51.94 27.43,51.94 26.8,51.31 24.51,51.31 23.5,52.32 v23.5,52.45 R3.1
N$2  (via drill 0.38)
  Top 0.254: C5.2 26.36,54.48 C4.1
  Top 0.305: U$1.25 34.7,48.28 34.67,48.26 v35.05,47.88 | v26.16,52.32 26.16,54.04 C4.1
  Bottom 0.305: v35.05,47.88 35.05,50.29 32.51,52.83 26.54,52.83 26.16,52.45 | 26.16,52.45 v26.16,52.32 | R4.1 26.04,52.58 26.16,52.45
N$3  (via drill 0.38)
  Top 0.254: C5.1 28.26,55.76 C6.2 28.7,54.36 v28.58,54.48
  Top 0.305: U$1.24 35.18,50.42 34.54,51.05 33.66,51.05 31.75,52.96 30.35,52.96 29.72,53.59 29.72,54.3 C6.2
  Bottom 0.203: R5.1 v28.58,54.48
N$4  (via drill 0.38)
  Top 0.254: C7.2 30.93,54.99 C6.1 31.18,54.36 v31.12,54.42
  Top 0.305: U$1.23 35.69,50.67 34.54,51.82 33.91,51.82 33.02,52.7 33.02,53.59 32.51,54.36 C6.1
  Bottom 0.254: v31.12,54.42 R6.1 v31.12,54.42
N$5  (via drill 0.38)
  Top 0.305: 34.16,53.34 36.2,51.31 U$1.22 36.2,48.13 v37.08,47.24 | 34.16,53.34 v34.16,52.7 | C7.1 32.83,56.2 34.16,54.86 34.16,53.34
  Bottom 0.305: v34.16,52.7 34.16,53.95 R7.1 | v37.08,47.24 38.02,47.24 U$2.P$1
N$6  (via drill 0.38)
  Top 0.305: U$1.21 36.68,51.71 36.32,52.07 | 36.32,52.07 35.18,53.21 35.18,56.83 C8.2 | v36.32,52.83 36.32,52.07
  Bottom 0.305: R13.1 35.94,53.34 36.32,52.96 v36.32,52.83
N$7  (via drill 0.38)
  Top 0.305: U$1.19 37.69,52.3 38.48,53.09 42.55,53.09 | 42.55,53.09 v42.55,52.96 | C10.2 43.37,53.91 42.55,53.09 | R9.1 41.53,56.32 C9.1
  Bottom 0.305: v42.55,52.96 41.91,52.96 41.27,53.59 R9.1
  other vias: 41.53,54.46
N$8  (via drill 0.38)
  Top 0.305: U$1.18 38.18,51.51 38.86,52.2 43.05,52.2 v43.81,52.83 44.83,52.83 45.15,53.15 C11.2 45.27,54.48 C10.1
  Bottom 0.305: v43.81,52.83 R10.1
N$9  (via drill 0.38)
  Top 0.305: U$1.17 38.68,51 39.37,51.69 v44.32,51.69 45.21,51.69 47.05,53.78 C11.1 47.18,54.49 C12.2
  Bottom 0.305: v44.32,51.69 45.21,51.69 46.35,52.96 R11.1
N$10  (via drill 0.38)
  Top 0.305: C12.1 49.08,53.15 v48.9,52.96 48.9,52.7 48.51,52.32 46.99,52.32 45.59,50.93 39.75,50.93 39.19,50.37 U$1.16 39.24,49.48 39.24,48.64 39.83,48.06 U$9.P$1
  Bottom 0.305: R12.1 v48.9,52.96
N$11  (via drill 0.38)
  Top 0.406: v28.58,59.05 27.81,59.05 26.16,60.71 24.89,60.71 24.26,61.34 24.26,64.52 U$33.4
  Bottom 0.406: R5.2 v28.58,59.05
N$12  (via drill 0.38)
  Top 0.254: C2.2 20.38,55.06 v20.95,54.48
  Top 0.305: U$1.27 33.68,47.78 v33.02,47.12
  Bottom 0.203: R2.1 v20.95,54.48
  Bottom 0.305: v33.02,47.12 33.02,50.29 32,51.31 27.81,51.31 26.92,50.42 22.35,50.42 20.95,51.82 R2.1
N$13
  Top 0.203: U$20.27 83.93,56.27 84.58,55.63 84.58,53.72 83.69,52.83 LED8.A
N$14
  Top 0.406: C26.2 C27.1
N$15  (via drill 0.38)
  Top 0.406: v26.04,59.05 25.53,59.05 24.51,60.07 22.86,60.07 22.23,60.71 22.23,64.52 U$33.3
  Bottom 0.406: R4.2 v26.04,59.05
N$16  (via drill 0.38)
  Top 0.406: v31.12,59.05 29.97,59.05 28.19,60.83 27.18,60.83 26.42,61.59 26.42,64.36 U$33.5
  Bottom 0.406: v31.12,59.05 R6.2
N$17
  Top 0.203: R37.2 LED8.C
N$18  (via drill 0.38)
  Top 0.406: v38.73,59.05 39.62,59.05 41.66,61.09 41.66,64.49 U$24.1
  Bottom 0.406: R8.2 v38.73,59.05
N$19  (via drill 0.38)
  Top 0.406: v41.53,59.05 41.91,59.05 43.56,60.71 43.56,64.49 U$24.2
  Bottom 0.406: v41.53,59.05 R9.2
N$20  (via drill 0.38)
  Top 0.406: v43.81,59.05 44.32,59.05 45.59,60.33 45.59,64.52 U$24.3
  Bottom 0.406: v43.81,59.05 R10.2
N$21  (via drill 0.38)
  Top 0.406: v46.35,59.05 46.61,59.05 47.62,60.07 47.62,64.52 U$24.4
  Bottom 0.406: R11.2 v46.35,59.05
N$22  (2 unrouted)
  Top 0.152: U$20.23 79.31,51.89 80.39,50.8 80.39,43.16 R1.1 78.75,40.62
N$23  (via drill 0.38)
  Top 0.203: C13.1 38.61,54.61 v38.73,54.48
  Top 0.305: U$1.20 37.19,52.93 38.54,54.29 C13.1 39.05,55.12 C9.2
  Bottom 0.203: v38.73,54.48 R8.1
N$24  (via drill 0.38)
  Top 0.305: U$26.1 43.88,44.39 43.31,43.81 v43.31,42.8 | v39.12,37.08 36.96,37.08 36.32,37.72 36.32,38.8 R16.2
  Bottom 0.305: v43.31,42.8 43.31,38.23 42.67,37.59 40.26,37.59 39.75,37.08 v39.12,37.08
N$25
  Top 0.305: U$1.7 35.18,39.44 C20.2
N$26  (via drill 0.38)
  Top 0.305: U$1.29 32.69,48.56 32.51,48.39 13.59,48.39 12.19,46.99 12.19,44.32 v11.94,44.07 | v13.97,43.69 13.97,40.77 14.99,39.75 C14.1 | C14.1 C16.2 | C14.1 14.98,35.12 R15.1
  Bottom 0.305: v11.94,44.07 13.59,44.07 v13.97,43.69
N$27
  Bottom 0.305: S3.4 S3.3 | R54.2 8.76,65.3 S3.4 | JP3.1 4.7,54.86 3.3,56.26 3.3,59.84 S3.4
N$28
  Top 0.305: U$1.28 33.2,48.18 32.89,47.88 14.35,47.88 12.95,46.48 12.95,37.78 C14.2 | C15.1 12.96,37.78 C14.2 | C14.2 13.08,35.12 R14.1
N$29  (1 unrouted)
N$30  (4 unrouted)
  Top 0.152: 77.46,40.62 U$8.2
N$32  (via drill 0.38)
  Top 0.305: R18.2 59.16,34.29 U$6.P$2 60.2,32.89 60.58,33.27 | 60.58,33.27 v60.58,34.29 | U$5.1 v35.43,18.54 | v51.69,30.73 60.32,30.73 60.58,30.99 60.58,33.27
  Bottom 0.305: v60.58,34.29 59.26,34.29 R19.1 | v35.43,18.54 34.42,18.54 33.91,19.05 33.91,29.46 35.43,30.99 51.44,30.99 v51.69,30.73
  Bottom 0.406: 60.07,33.78 v60.58,34.29
N$33  (via drill 0.38)
  Top 0.305: U$6.P$1 55.12,32.89 54.99,32.77 54.61,32.77 v54.48,32.64 54.29,32.84 U$7.3
  Bottom 0.305: v54.48,32.64 54.48,33.38 R19.2
N$34
  Top 0.305: U$1.2 32.69,42.6 32.26,42.16 30.48,42.16 29.84,41.53 29.84,36.96 31.75,35.05 51.75,35.05 U$7.2
N$35
  Top 0.305: C17.1 C18.2
N$36
  Top 0.203: U$20.26 83.72,55.47 83.95,55.24 83.95,53.98 83.57,53.59 82.8,53.59 82.42,53.21 82.42,51.85 LED7.A
N$37  (via drill 0.38)
  Top 0.203: U$1.12 37.69,44.81 37.97,45.09 38.48,45.09 38.73,44.83 38.73,43.74 U$1.14
  Top 0.305: U$1.11 U$1.12 | v40.01,42.29 39.12,42.29 38.73,42.67 38.73,43.64 U$1.14
  Bottom 0.305: C19.2 41.72,42.48 41.66,42.55 40.26,42.55 v40.01,42.29
N$38
  Top 0.305: U$1.13 38.18,42.47 39.81,40.83 R20.1
N$39  (via drill 0.38)
  Top 0.305: C17.2 29.59,11.94 28.32,13.21 v28.32,13.97
  Top 0.406: 16.64,18.16 16.64,31.56 R15.2
  other vias: 26.29,28.19 27.3,28.19 28.32,28.19 29.34,28.19 30.35,28.19 26.29,27.18 27.3,27.18 28.32,27.18 29.34,27.18 30.35,27.18 26.29,24.13 27.3,24.13 28.32,24.13 29.34,24.13 30.35,24.13 26.29,23.11 27.3,23.11 28.32,23.11 29.34,23.11 30.35,23.11 26.29,26.16 27.3,26.16 28.32,26.16 29.34,26.16 30.35,26.16 26.29,25.15 27.3,25.15 28.32,25.15 29.34,25.15 30.35,25.15 26.29,22.1 27.3,22.1 28.32,22.1 29.34,22.1 30.35,22.1 26.29,21.08 27.3,21.08 28.32,21.08 29.34,21.08 30.35,21.08 26.29,13.97 27.3,13.97 29.34,13.97 30.35,13.97 26.29,16 27.3,16 28.32,16 29.34,16 30.35,16 26.29,14.99 27.3,14.99 28.32,14.99 29.34,14.99 30.35,14.99 26.29,18.03 27.3,18.03 28.32,18.03 29.34,18.03 30.35,18.03 26.29,17.02 27.3,17.02 28.32,17.02 29.34,17.02 30.35,17.02 26.29,20.07 27.3,20.07 28.32,20.07 29.34,20.07 30.35,20.07 26.29,19.05 27.3,19.05 28.32,19.05 29.34,19.05 30.35,19.05
  pour Bottom: 33.66,12.06 33.4,29.84 16.51,29.84 16.51,12.06
  pour Top: 16.64,11.94 16.64,29.97 33.66,29.97 33.66,11.94
N$42  (via drill 0.38)
  Top 0.203: 49.99,23.62 U$4.1
  Top 0.305: U$1.1 32.18,42.98 31.88,42.67 25.4,42.67 23.37,40.64 23.37,35.73 R17.2 23.41,34.38 25.53,32.26 v26.29,32.26 | v53.72,23.62 49.99,23.62
  Bottom 0.305: v26.29,32.26 52.2,32.26 54.23,30.23 54.23,24.13 v53.72,23.62
N$70  (via drill 0.38)
  Top 0.305: U$26.2 47.81,46.29 48.01,46.48 v48.01,46.61
  Bottom 0.305: R51.1 45.22,46.03 U$27.P$1 46.18,46.99 47.62,46.99 v48.01,46.61
N$71
  Top 0.203: U$20.12 64.1,59.47 62.23,61.34 62.23,68.96 JP1.2
  Bottom 0.406: JP1.2 62.48,68.2 61.85,67.56 61.85,66.69 R60.1
N$72
  Top 0.406: R35.2 44.36,45.37 U$26.3
N$76
  Top 0.203: R59.2 82.42,50.2 LED7.C
N$77  (via drill 0.38)
  Top 0.203: U$22.7 72.14,48.51 72.26,48.64 72.26,53.34 71.88,53.72 v71.75,53.72 | v79.88,61.85 82.06,61.85 U$20.34
  Bottom 0.203: v71.75,53.72 71.75,52.96 72.14,52.58 77.22,52.58 79.25,54.61 79.25,61.34 79.76,61.85 v79.88,61.85
N$81
  Bottom 0.152: U$25.2 68.34,44.46 67.82,43.94 64.53,43.94 C41.2
N$84
  Bottom 0.152: U$32.P$4 68.34,47.1 68.71,46.74 68.71,46.23 68.83,46.1 C40.1
P2_1  (via drill 0.38)
  Top 0.203: U$20.10 64.38,61.07 v64.13,60.83 | v62.61,46.35 66.38,46.35 U$22.4
  Bottom 0.203: v64.13,60.83 64.13,51.82 62.87,50.55 62.87,46.61 v62.61,46.35
P2_2  (via drill 0.38)
  Top 0.203: U$22.3 72.39,45.97 72.77,46.35 72.77,53.34 v73.28,53.85 | v65.79,62.1 66.17,62.1 66.42,61.85 74.1,61.85 U$20.9
  Bottom 0.203: v73.28,53.85 73.28,56.64 72.64,57.28 67.06,57.28 65.28,59.05 65.28,61.59 v65.79,62.1
PACK+  (via drill 0.38)
  other vias: 69.85,5.59 68.58,5.59 67.31,5.59 66.04,5.59 64.77,5.59 69.85,4.45 68.58,4.45 67.31,4.45 66.04,4.45 64.77,4.45 69.85,3.3 68.58,3.3 67.31,3.3 66.04,3.3 64.77,3.3 69.85,2.16 68.58,2.16 67.31,2.16 66.04,2.16 64.77,2.16 63.5,2.16 62.23,2.16 60.96,2.16 59.69,2.16 58.42,2.16 63.5,3.3 62.23,3.3 60.96,3.3 59.69,3.3 58.42,3.3 63.5,4.45 62.23,4.45 60.96,4.45 59.69,4.45 58.42,4.45 63.5,5.59 62.23,5.59 60.96,5.59 59.69,5.59 58.42,5.59 14.61,5.59 15.88,5.59 17.14,5.59 18.41,5.59 19.68,5.59 14.61,4.45 15.88,4.45 17.14,4.45 18.41,4.45 19.68,4.45 14.61,3.3 15.88,3.3 17.14,3.3 18.41,3.3 19.68,3.3 14.61,2.16 15.88,2.16 17.14,2.16 18.41,2.16 19.68,2.16 20.95,2.16 22.23,2.16 23.5,2.16 24.77,2.16 26.04,2.16 20.95,3.3 22.23,3.3 23.5,3.3 24.77,3.3 26.04,3.3 20.95,4.45 22.23,4.45 23.5,4.45 24.77,4.45 26.04,4.45 20.95,5.59 22.23,5.59 23.5,5.59 24.77,5.59 26.04,5.59 23.5,10.29 24.77,10.29 26.04,10.29 27.3,10.29 28.58,10.29 23.5,9.14 24.77,9.14 26.04,9.14 27.3,9.14 28.58,9.14 23.5,8 24.77,8 26.04,8 27.3,8 28.58,8 23.5,6.86 24.77,6.86 26.04,6.86 27.3,6.86 28.58,6.86 29.84,6.86 31.12,6.86 32.38,6.86 33.66,6.86 34.92,6.86 29.84,8 31.12,8 32.38,8 33.66,8 34.92,8 29.84,9.14 31.12,9.14 32.38,9.14 33.66,9.14 34.92,9.14 29.84,10.29 31.12,10.29 32.38,10.29 33.66,10.29 34.92,10.29 49.66,10.29 50.93,10.29 52.2,10.29 53.47,10.29 54.74,10.29 49.66,9.14 50.93,9.14 52.2,9.14 53.47,9.14 54.74,9.14 49.66,8 50.93,8 52.2,8 53.47,8 54.74,8 49.66,6.86 50.93,6.86 52.2,6.86 53.47,6.86 54.74,6.86 56.01,6.86 57.28,6.86 58.55,6.86 59.82,6.86 61.09,6.86 56.01,8 57.28,8 58.55,8 59.82,8 61.09,8 56.01,9.14 57.28,9.14 58.55,9.14 59.82,9.14 61.09,9.14 56.01,10.29 57.28,10.29 58.55,10.29 59.82,10.29 61.09,10.29
  pour Top: 0,0 85.72,0 85.72,11.43 0,11.43
  pour Bottom: 0,11.43 85.72,11.43 85.72,0 0,0
PACK-  (via drill 0.38)
  Top 0.305: v58.67,15.24 58.8,15.11 58.8,12.7 58.04,11.94 C18.1 47.81,10.67 40.77,10.67 40.26,11.18 22.73,11.18 22.48,10.92 U$30.P$1
  other vias: 71.12,29.21 72.39,29.21 73.66,29.21 74.93,29.21 76.2,29.21 71.88,16.64 73.15,16.64 74.42,16.64 75.69,16.64 76.96,16.64 71.88,15.49 73.15,15.49 74.42,15.49 75.69,15.49 76.96,15.49 71.88,14.35 73.15,14.35 74.42,14.35 75.69,14.35 76.96,14.35 71.88,13.21 73.15,13.21 74.42,13.21 75.69,13.21 76.96,13.21 78.23,13.21 79.5,13.21 80.77,13.21 82.04,13.21 83.31,13.21 78.23,14.35 79.5,14.35 80.77,14.35 82.04,14.35 83.31,14.35 78.23,15.49 79.5,15.49 80.77,15.49 82.04,15.49 83.31,15.49 78.23,16.64 79.5,16.64 80.77,16.64 82.04,16.64 83.31,16.64 77.47,25.78 78.74,25.78 80.01,25.78 81.28,25.78 82.55,25.78 71.12,25.78 72.39,25.78 73.66,25.78 74.93,25.78 76.2,25.78 71.12,26.92 72.39,26.92 73.66,26.92 74.93,26.92 76.2,26.92 71.12,28.07 72.39,28.07 73.66,28.07 74.93,28.07 76.2,28.07 77.47,28.07 78.74,28.07 80.01,28.07 81.28,28.07 82.55,28.07 77.47,29.21 78.74,29.21 80.01,29.21 81.28,29.21 82.55,29.21 77.47,26.92 78.74,26.92 80.01,26.92 81.28,26.92 82.55,26.92 58.67,21.59 58.67,22.86 58.67,24.13 58.67,25.4 58.67,26.67 59.82,21.59 59.82,22.86 59.82,24.13 59.82,25.4 59.82,26.67 60.96,21.59 60.96,22.86 60.96,24.13 60.96,25.4 60.96,26.67 62.1,21.59 62.1,22.86 62.1,24.13 62.1,25.4 62.1,26.67 62.1,15.24 62.1,16.51 62.1,17.78 62.1,19.05 62.1,20.32 60.96,15.24 60.96,16.51 60.96,17.78 60.96,19.05 60.96,20.32 59.82,15.24 59.82,16.51 59.82,17.78 59.82,19.05 59.82,20.32 58.67,16.51 58.67,17.78 58.67,19.05 58.67,20.32
  pour Top: 54.61,11.94 54.61,29.97 85.72,29.97 85.72,11.94
  pour Bottom: 54.61,29.97 85.72,29.97 85.72,11.94 54.61,11.94
REGOUT  (via drill 0.38)
  Top 0.203: 68.71,54.86 68.71,52.58 67.44,51.31 v67.44,50.93 v64.9,50.93 | C28.1 66.69,62.6 64.64,64.64 64.64,70.36 63.63,71.37 60.71,71.37 59.94,70.61 JP1.1 | v57.91,43.18 64.39,43.18 v65.91,44.7
  Top 0.254: U$22.2 v65.91,44.7
  Top 0.305: U$1.8 v35.69,45.47 | v41.78,43.43 41.78,42.42 42.29,41.91 C44.2 | 73.53,55.47 U$20.17 | 73.53,55.47 71.76,55.47 R58.2 R57.2 | U$20.8 76.14,62.67 76.84,61.98 76.84,56.39 76.07,55.63 75.69,55.63 75.56,55.5 73.56,55.5 73.53,55.47
  Top 0.406: U$20.8 71.32,62.67 C29.1 C28.1 | U$8.3 78.05,37.97 78.04,36.45 77.53,35.94 66.04,35.94 63.25,38.73 59.56,38.73 57.91,40.39 v57.91,43.18 57.91,52.45 59.44,53.98 67.82,53.98 68.71,54.86 R57.2 | C44.2 49.78,41.91 50.29,42.42 v51.05,42.42
  Bottom 0.152: C39.1 65.14,47.64 65.28,47.5 U$32.P$8
  Bottom 0.203: v67.44,50.93 67.44,49.55 C42.2 67.42,48.44 67.53,48.32 67.9,48.32 U$32.P$1 68.41,48.3 68.58,48.51 69.2,48.51 C33.1 C38.1 71.26,48.51 71.75,48.01 71.75,45.34 71.36,44.94 U$25.4 | C39.1 64.39,50.67 64.64,50.93 v64.9,50.93 | 65.91,44.94 64.37,44.94 C43.1 | 65.91,44.94 66.76,44.94 U$25.1 | v65.91,44.7 65.91,44.94
  Bottom 0.254: U$25.1 66.76,44.94
  Bottom 0.305: v35.69,45.47 36.2,44.96 40.64,44.96 41.02,44.58 41.02,43.56 41.27,43.31 41.66,43.31 v41.78,43.43
  Bottom 0.406: v51.05,42.42 53.33,42.42 C31.1 C30.1 C32.1 57.42,42.43 57.91,42.93 v57.91,43.18
REGSRC  (via drill 0.38)
  Top 0.305: U$1.9 36.2,41.78 36.07,41.66 v36.07,41.53
  Bottom 0.305: v36.07,41.53 C25.2 36.64,39.69 37.46,38.86 37.46,36.7 37.97,36.2 42.42,36.2 43.94,37.72 43.94,42.04 44.58,42.67 R51.2 45.73,44.13 U$27.P$2
SCL  (via drill 0.38)
  Top 0.152: v67.18,55.75 67.18,56.91 67.31,57.04
  Top 0.203: v62.23,54.86 62.23,57.04 | U$1.5 34.19,44.93 33.66,45.47 30.99,45.47 30.23,44.7 30.23,44.32 v29.97,44.07
  Top 0.305: 53.59,49.66 52.32,48.39 v52.32,46.1
  Top 0.406: U$20.14 69.54,57.87 R57.1 67.31,57.04 62.23,57.04 56.28,57.04 53.59,54.36 53.59,49.66
  Bottom 0.152: U$32.P$2 66.78,47.9 66.55,48.13 66.55,55.24 67.06,55.75 v67.18,55.75
  Bottom 0.203: JP5.2 70.99,40.13 69.6,41.53 67.69,41.53 67.09,42.13 U$25.8 61.45,42.94 59.82,44.58 59.82,52.45 v62.23,54.86
  Bottom 0.305: v29.97,44.07 29.97,43.43 32.64,40.77 32.64,35.56 33.66,34.54 46.23,34.54 49.02,37.34 49.02,42.67 52.32,45.97 v52.32,46.1
SDA  (via drill 0.38)
  Top 0.203: U$1.4 33.68,44.68 33.4,44.96 31.62,44.96 31.24,44.58 v31.24,44.2
  Top 0.406: U$20.15 71.54,57.07 R58.1 70.63,57.04 v70.23,56.64
  Bottom 0.152: U$32.P$10 65.93,56.02 66.55,56.64
  Bottom 0.203: 72.96,41.85 72.77,42.04 68.71,42.04 68.34,42.41 U$25.7 68.34,43.32 | 72.96,41.85 73.53,41.27 JP5.3 | v70.23,56.64 70.23,52.83 72.64,50.42 72.64,42.16 72.96,41.85
  Bottom 0.305: 52.7,47.88 47.62,42.8 47.62,37.21 45.85,35.43 33.91,35.43 33.27,36.07 33.27,40.89 31.24,42.93 v31.24,44.2
  Bottom 0.406: v70.23,56.64 66.55,56.64 56.13,56.64 53.72,54.23 53.72,48.9 52.7,47.88
VC5X  (via drill 0.38)
  Top 0.305: C13.2 36.64,56.39 C8.1 v37.15,61.72 37.15,64.45 36.45,65.15 C1.1 | v40.01,39.12 38.54,39.12 R16.1 37.91,39.24 R20.2 36.68,42 U$1.10 36.68,45.7 v36.83,45.85
  Top 0.406: C21.2 C1.1
  Bottom 0.305: C19.1 40.83,39.69 40.26,39.12 v40.01,39.12 | v36.83,45.85 36.14,46.61 U$2.P$2 35.51,46.94 36.32,47.75 36.32,51.44 37.46,52.58 37.34,58.83 R24.1 36.6,61.18 v37.15,61.72
VC10X  (via drill 0.38)
  Top 0.305: U$1.15 39.19,44.53 39.62,44.96 40.84,44.96 U$9.P$2 v40.89,46.48 | C1.2 33.15,62.35 v32.89,62.61 | v54.48,61.98 54.48,59.72 R30.1 54.51,57.3 51.56,54.36 51.56,49.53 49.4,47.37 v49.4,47.5
  Bottom 0.305: v32.89,62.61 32.89,63.12 33.15,63.37 53.21,63.37 54.48,62.1 v54.48,61.98 | v49.4,47.5 48.26,47.5 47.5,48.26 43.05,48.26 41.4,46.61 41.02,46.61 v40.89,46.48

### Text on the board
tPlace: Pressure Sensor | BOOT | BOOT | BQ76930 | ESC | GND | CLK | DATA | SMBus/I2C | BATT- | DISCHARGE- | Longboard Battery Management v1.3 | BATT+ | Charles Hood | DISCHARGE+
bPlace: CHARGE- | CHARGE+